# Altium schematic sheet wearable_sch.SchDoc: Medibox Wearable
size 431 x 279 mm; Author: Dhimant Tewari; DrawnBy: Aakashdip Dey; Organization: Vellore Institue of Technology; Address1: ADDRESS 1; Address2: ADDRESS 2; Address3: ADDRESS 3; Address4: ADDRESS 4; Revision: -; SheetNumber: 1; SheetTotal: 1; ENG_APP_DATE: --/--/--; DSN_APP_DATE: --/--/--; CHK_APP_DATE: --/--/--
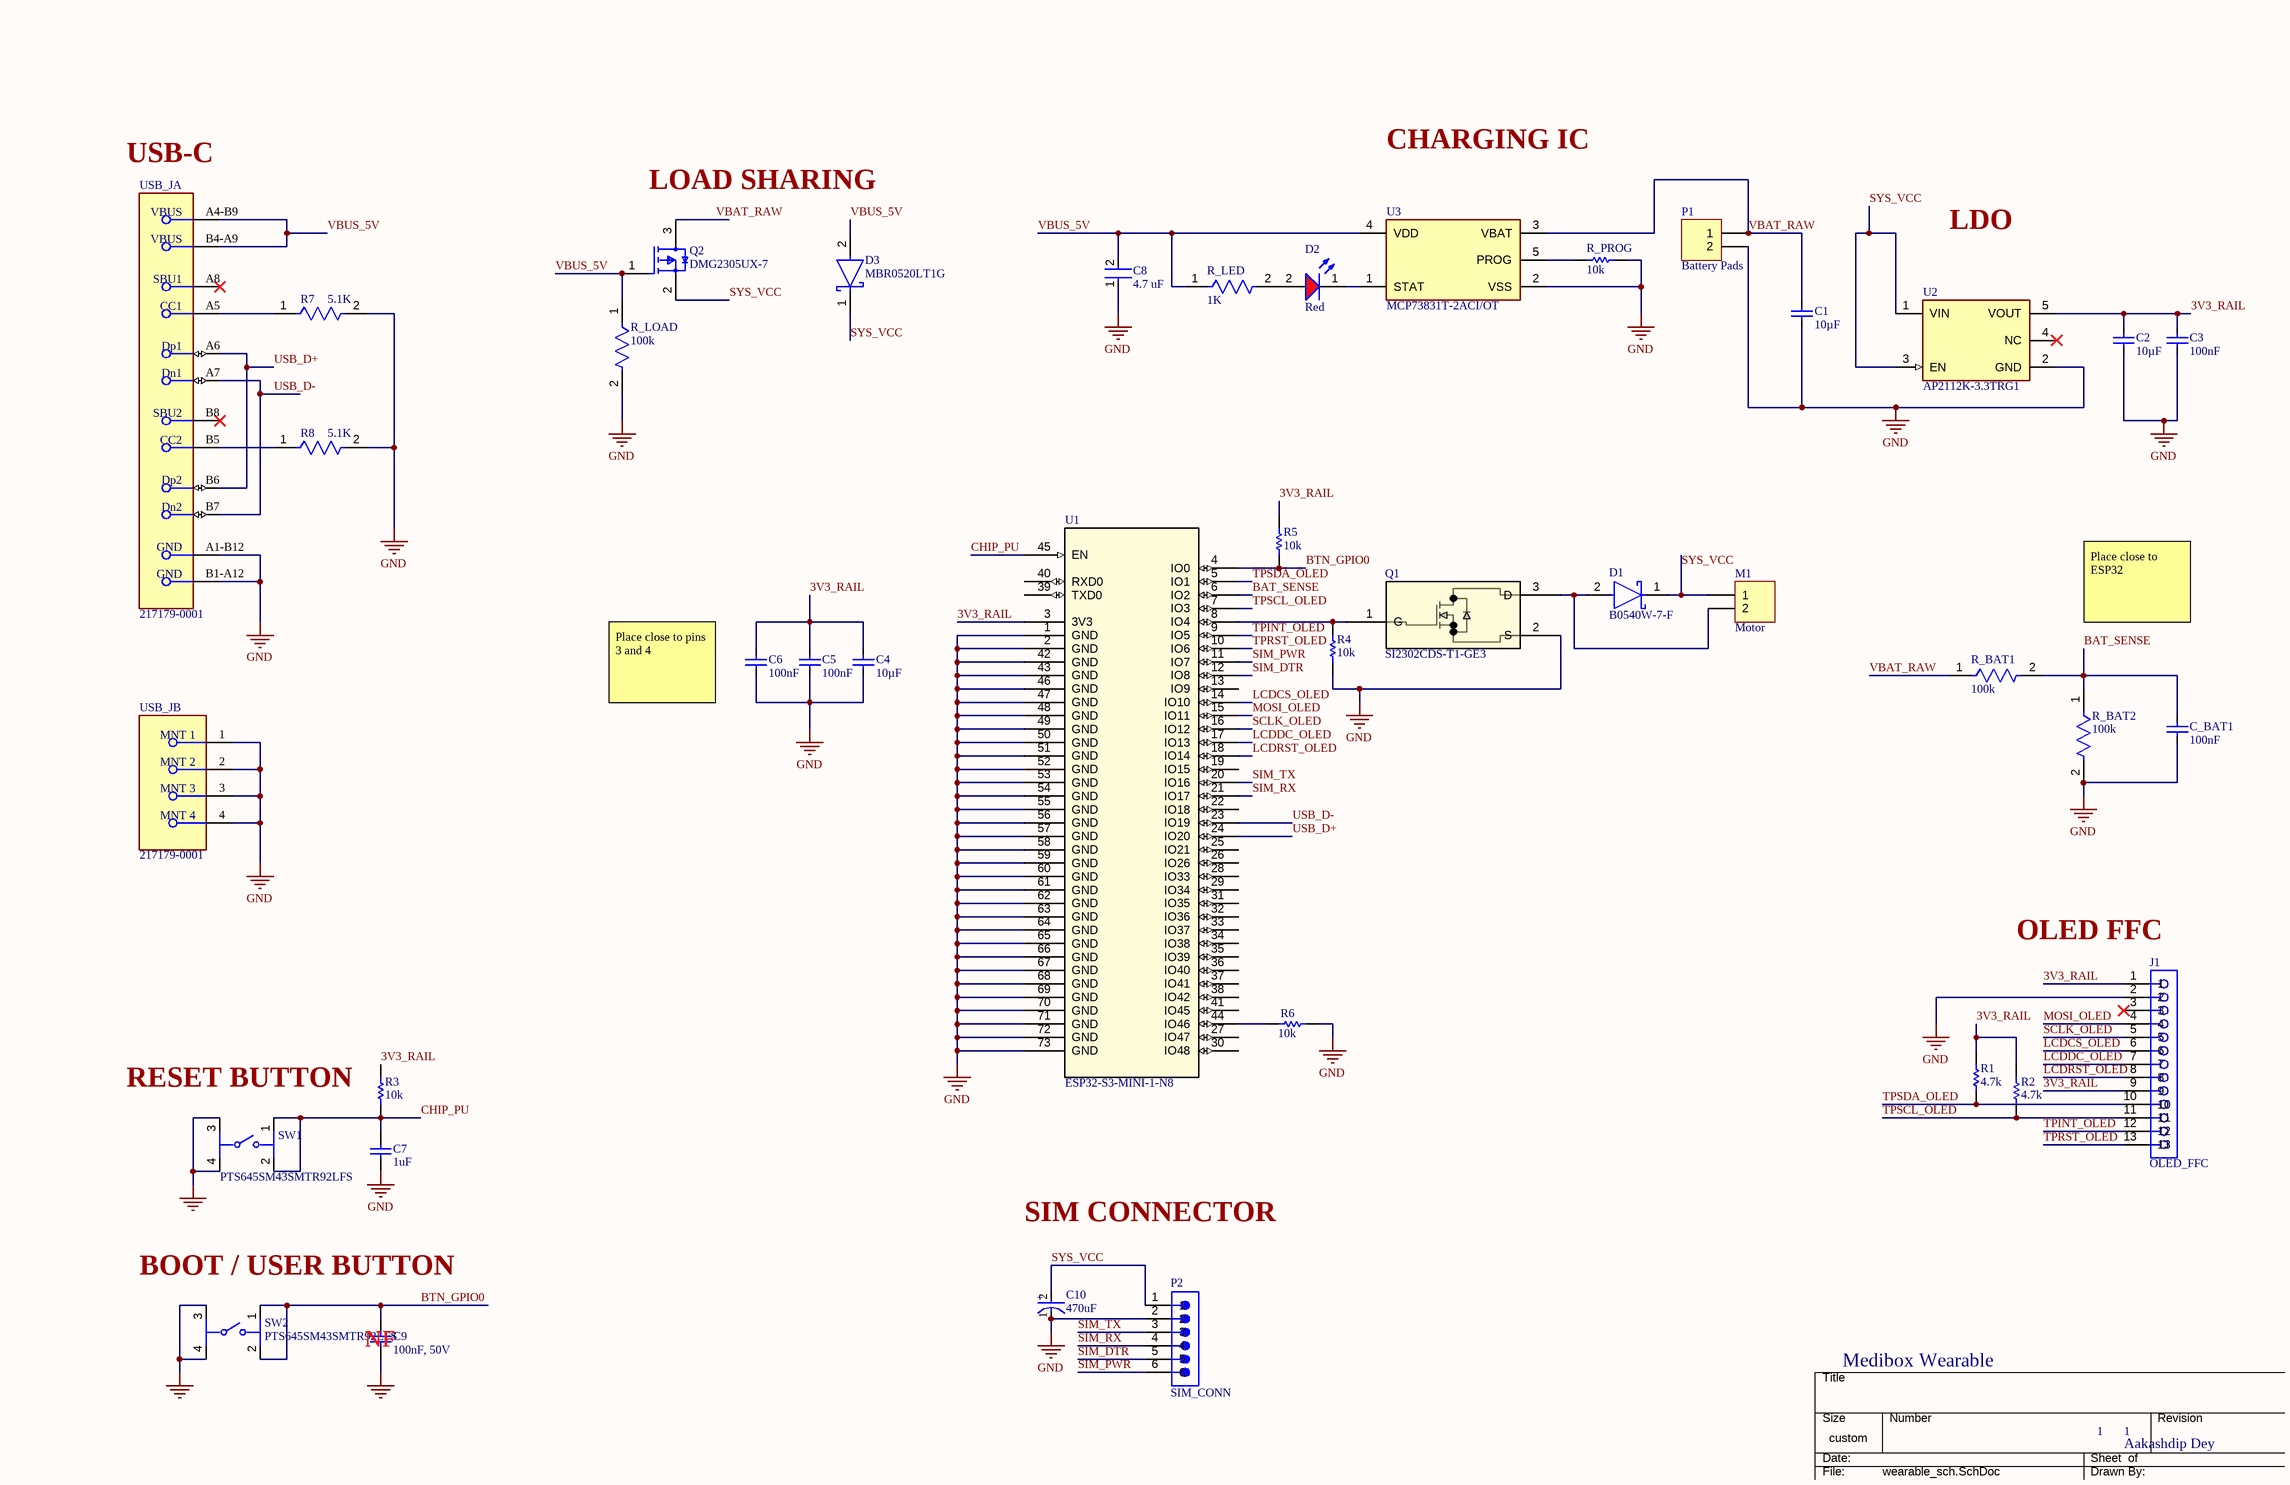
[diagram p0: wearable_sch.SchDoc]

## Parts
C1  value 10µF  [CAPC2013X135X45ML10T25]  (hidden comment: CAP_Murata)
C2  value 10µF  [CAPC2013X135X45ML10T25]  (hidden comment: CAP_Murata)
C3  100nF  [0603C_L]
C4  value 10µF  [CAPC2013X135X45ML10T25]  (hidden comment: CAP_Murata)
C5  100nF  [0603C_L]
C6  100nF  [0603C_L]
C7  1uF  [CAPC2013X145X50LL20T25]
C8  4.7 uF  [FP-GCM21B-0_15-IPC_A]
C9  100nF, 50V  [0603C_L]
C10  470uF  [FP-ECAS-D4-MFG]
C_BAT1  100nF  [0603C_L]
D1  B0540W-7-F  [FP-SOD123-MFG]
D2  Color: Red  [0603_A]  (hidden comment: LED_Red0603)
D3  MBR0520LT1G  [FP-425-04-IPC_C]
J1  OLED_FFC  [MOLX-52806-1310]
M1  Motor  [HDR1X2]
P1  Battery Pads  [HDR1X2]
P2  SIM_CONN  [SMTC-TSW-106-23-X-S]
Q1  SI2302CDS-T1-GE3  [TO-236_VIS-L]
Q2  DMG2305UX-7  [FP-SOT23-IPC_B]
R1  4.7k  [0603_L]
R2  4.7k  [0603_L]
R3  10k  [0603_L]
R4  10k  [0603_L]
R5  10k  [0603_L]
R6  10k  [0603_L]
R7  5.1K  [FP-CRCW0402-e3-IPC_A]
R8  5.1K  [FP-CRCW0402-e3-IPC_A]
R_BAT1  100k  [FP-MCS0402-MFG]
R_BAT2  100k  [FP-MCS0402-MFG]
R_LED  1K  [FP-AC0402-IPC_C]
R_LOAD  100k  [FP-MCS0402-MFG]
R_PROG  10k  [0603_L]
SW1  PTS645SM43SMTR92LFS  [FP-PTS645SM43SMTR92LFS-MFG]
SW2  PTS645SM43SMTR92LFS  [FP-PTS645SM43SMTR92LFS-MFG]
U1  ESP32-S3-MINI-1-N8  [ESP32-S3-MINI-1_EXP]
U2  AP2112K-3.3TRG1  [FP-SOT25-IPC_A]
U3  MCP73831T-2ACI/OT  [FP-C04-091-OT-IPC_B]
USB_J  217179-0001  [FP-2171790001-MFG]  (parts A,B of 2)

## Nets
GND: C1.2 C2.1 C3.1 C4.1 C5.1 C6.1 C7.1 C8.1 C9.1 C10.1(C) C_BAT1.1 J1.2 P1.2 P2.2 Q1.2(S) R4.1 R6.2 R7.2 R8.2 R_BAT2.2 R_LOAD.2 R_PROG.2 SW1.3 SW1.4 SW2.3 SW2.4 U1.1(GND) U1.2(GND) U1.42(GND) U1.43(GND) U1.46(GND) U1.47(GND) U1.48(GND) U1.49(GND) U1.50(GND) U1.51(GND) U1.52(GND) U1.53(GND) U1.54(GND) U1.55(GND) U1.56(GND) U1.57(GND) U1.58(GND) U1.59(GND) U1.60(GND) U1.61(GND) U1.62(GND) U1.63(GND) U1.64(GND) U1.65(GND) U1.66(GND) U1.67(GND) U1.68(GND) U1.69(GND) U1.70(GND) U1.71(GND) U1.72(GND) U1.73(GND) U2.2(GND) U3.2(VSS) USB_J.1(MNT_1) USB_J.2(MNT_2) USB_J.3(MNT_3) USB_J.4(MNT_4) USB_J.A1-B12(GND) USB_J.B1-A12(GND)
3V3_RAIL: C2.2 C3.2 C4.2 C5.2 C6.2 J1.1 J1.9 R1.2 R2.2 R3.1 R5.2 U1.3(3V3) U2.5(VOUT)
BAT_SENSE: C_BAT1.2 R_BAT1.2 R_BAT2.1 U1.6(IO2)
BTN_GPIO0: C9.2 R5.1 SW2.1 SW2.2 U1.4(IO0)
CHIP_PU: C7.2 R3.2 SW1.1 SW1.2 U1.45(EN)
LCDCS_OLED: J1.6 U1.14(IO10)
LCDDC_OLED: J1.7 U1.17(IO13)
LCDRST_OLED: J1.8 U1.18(IO14)
MOSI_OLED: J1.4 U1.15(IO11)
SCLK_OLED: J1.5 U1.16(IO12)
SIM_DTR: P2.5 U1.12(IO8)
SIM_PWR: P2.6 U1.11(IO7)
SIM_RX: P2.4 U1.21(IO17)
SIM_TX: P2.3 U1.20(IO16)
SYS_VCC: C10.2(A) D1.1(C) D3.1(C) M1.1 P2.1 Q2.2(SOURCE) U2.1(VIN) U2.3(EN)
TPINT_OLED: J1.12 U1.9(IO5)
TPRST_OLED: J1.13 U1.10(IO6)
TPSCL_OLED: J1.11 R2.1 U1.7(IO3)
TPSDA_OLED: J1.10 R1.1 U1.5(IO1)
USB_D+: U1.24(IO20) USB_J.A6(Dp1) USB_J.B6(Dp2)
USB_D-: U1.23(IO19) USB_J.A7(Dn1) USB_J.B7(Dn2)
VBAT_RAW: C1.1 P1.1 Q2.3(DRAIN) R_BAT1.1 U3.3(VBAT)
VBUS_5V: C8.2 D3.2(A) Q2.1(GATE) R_LED.1 R_LOAD.1 U3.4(VDD) USB_J.A4-B9(VBUS) USB_J.B4-A9(VBUS)
NetD1_2: D1.2(A) M1.2 Q1.3(D)
NetD2_1: D2.1(K) U3.1(STAT)
NetD2_2: D2.2(A) R_LED.2
NetQ1_1: Q1.1(G) R4.2 U1.8(IO4)
NetR6_1: R6.1 U1.44(IO46)
NetR7_1: R7.1 USB_J.A5(CC1)
NetR8_1: R8.1 USB_J.B5(CC2)
NetR_PROG_1: R_PROG.1 U3.5(PROG)

Not connected (* = marked no-connect by the designer): J1 3*; U1 13(IO9) 19(IO15) 22(IO18) 25(IO21) 26(IO26) 27(IO47) 28(IO33) 29(IO34) 30(IO48) 31(IO35) 32(IO36) 33(IO37) 34(IO38) 35(IO39) 36(IO40) 37(IO41) 38(IO42) 39(TXD0) 40(RXD0) 41(IO45); U2 4(NC)*; USB_J A8(SBU1)* B8(SBU2)*

## Notes on the sheet
- (near USB_J) USB-C
- CHARGING IC
- LOAD SHARING
- LDO
- Place close to ESP32
- (near C6) Place close to pins 3 and 4
- (near J1) OLED FFC
- (near SW1) RESET BUTTON
- SIM CONNECTOR
- BOOT / USER BUTTON
- (near C9) NF
- 1
- DWG. NO.
- REV.
- SHT.
- THIS DOCUMENT AND THE DATA DISCLOSED HEREIN OR HEREWITH IS THE PROPERTY OF ALTIUM LIMITED AND MAY BE FREELY DISTRIBUTED IN WHOLE. NO RIGHTS ARE RESERVED OR EXPRESS OR IMPLIED WARANTEE GIVEN.
- REVISION
- DESCRIPTION
- DATE
- APPROVED
- ENG:
- APPROVALS
- PROJECT
- DSN:
- CHK:
- REFERENCE DOCUMENTS
- PROJECT REVISION:
- TITLE
- DOCUMENT REVISION:
- DESIGN ITEM:
- BOM:
- FAB DWG:
- PCB DWG:
- ASSY DWG:
- SCALE:
- SIZE
- B
- CAGE CODE
- FILE NAME
- DWG NO.
- SHEET
- OF
- REV
- (in symbol CMP-00260-140750078-1) +

## Library data of the parts
C1 C2 C4 = CAP_10uF_25V_0805: Ceramic Capacitor, Multilayer, Ceramic, 25V, 10% +Tol, 10% -Tol, X5R, 15% TC, 10uF, Surface Mount, 0805; Manufacturer: Murata; Manufacturer Part Number: GRM21BR61E106KA73L; Tolerance: 10%; Case/Package: 0805; Max Operating Temperature: 85°C; Min Operating Temperature: -55°C; Mounting Technology: Surface Mount; Pins: 2; RoHS Compliant: Yes; Capacitor Type: Ceramic; Component Type: Capacitors
C3 C5 C6 C_BAT1 = Cap100nF_50V_0603: Ceramic Capacitor, Multilayer, Ceramic, 50V, 80% +Tol, 20% -Tol, Y5V, -82/+22% TC, 0.1uF, Surface Mount, 0603; Manufacturer: Yageo; Manufacturer Part Number: CC0603ZRY5V9BB104; Multilayer: Yes; Packaging: Tape and Reel; Case/Package: 0603; Dielectric Material: Ceramic; Height: 0.8mm; Length: 1.6mm; Max Operating Temperature: 85°C; Min Operating Temperature: -30°C; Mounting Technology: Surface Mount; Pins: 2; RoHS Compliant: Yes; Termination: Wraparound; Value: 100nF; Voltage Rating: 50V; Width: 0.8mm; Capacitor Type: Ceramic; JESD-609 Code: e3; Package Shape: Rectangular; Package Style: SMTMeter; Rated DC Voltage (URdc): 50V; Reach SVHC Compliant: Yes; Temperature Characteristics Code: Y5V; Terminal Finish: Nickel; Tolerance  (fill in as +-): 20%; Tolerance (fill in as +-): 80%; Component Type: Capacitors
C7 = CMP-1036-04746-2: Manufacturer: Kemet; Part Number: C0805C105K4PACTU
C8 = CMP-06035-015394-1: Ceramic Capacitor for Automotive 4.7uF ±20% 16VDC X7R 0805 Embossed T/R
C9 = CL05B104KB54PNC: CAP CER 0.1UF 50V X7R 0402; Manufacturer: Samsung; Dielectric Material: Ceramic; Supplier: Digikey; Supplier Part Number: 1276-CL05B104KB54PNCCT-ND; Manufacturer Part Number: CL05B104KB54PNC; RoHS: Yes; Category: Ceramic Capacitors; Stock: 1237875; Pricing: 1=0.1, 10=0.044, 50=0.025, 100=0.0194, 500=0.0146, 1000=0.01147, 2500=0.01043, 5000=0.00959 (USD); Pins: 2; Capacitor Type: Ceramic; RoHS Compliant: Yes; Reach SVHC Compliant: Yes; ComponentLink1URL: https://datasheet.ciiva.com:443/pdfs/VipMasterIC/IC/SEMS/SEMS-S-A0006318249/SEMS-S-A0006320959-1.pdf?src-supplier=IHS+Markit; ComponentLink1Description: https://datasheet.ciiva.com:443/pdfs/VipMasterIC/IC/SEMS/SEMS-S-A0006318249/SEMS-S-A0006320959-1.pdf?src-supplier=IHS+Markit; ComponentLink2URL: https://datasheet.octopart.com/CL05B104KB54PNC-Samsung-datasheet-8326407.pdf?src-supplier=TME; ComponentLink2Description: https://datasheet.octopart.com/CL05B104KB54PNC-Samsung-datasheet-8326407.pdf?src-supplier=TME; LCSC Part Number: C307331
C10 = CMP-00260-140750078-1: ECASD40E477M006KA0 Cap, 470UF, 2.5V, Alu Polymer, 2917 Rohs Compliant: Yes; Tolerance: 20%; Life (Hours): 2000hours; Capacitance: 470µF; Dissipation Factor: 6%; Ripple Current: 7.5A; ESR (Equivalent Series Resistance): 6mΩ; Leakage Current: 117.5µA; Voltage Rating: 2.5V; Height: 2mm; NexarPartId: 140750078; Min Operating Temperature: -40°C; Case/Package: 2917; Max Operating Temperature: 105°C
D1 = CMP-2000-05880-2: DIODE SCHOTTKY 40V 500MA SOD123; Manufacturer: Diodes Inc.; Capacitance: 170pF; Max Junction Temp: +150°C; Value: 170pF; Peak Reverse Current: 20uA; Automotive Grade: Grade 0; Max Surge Forward Current: 5.5A; Standoff Height: 0mm; Forward Current: 0.5A; Digikey Description: DIODE SCHOTTKY 40V 500MA SOD123; ComponentLink2Description: Datasheet; Package: SOD123; Height: 1.45mm; Temperature Range High: +150°C; Mouser Description: Schottky Diodes & Rectifiers 40V 410mW; Category: Diode; Temperature: -65°C to +150°C; Reverse Voltage: 40V; Manufacturer Part Number: B0540W-7-F; Footprint Url: https://www.diodes.com/assets/Package-Files/SOD123.pdf; Octopart: https://octopart.com/b0540w-7-f-diodes+inc.-325656; Device Class L1: Discrete Semiconductors; Automotive: Yes; ComponentLink2URL: https://www.diodes.com/assets/Datasheets/ds30138.pdf; Lead Free: Yes; Temperature Range Low: -65°C; Device Class L3: Schottky Diodes; RoHS: TRUE; Max Repetitive Reverse Voltage: 40V; Device Class L2: Diodes
D2 = LED_Red0603: Single Color LED, Red, Water Clear, 1.1mm; Manufacturer: Wurth Electronics; Manufacturer Part Number: 150060RS75000; Viewing Angle: 140°; Overall Height: 0.7mm; Luminous Intensity-Nom: 250mcd; Forward Voltage: 2V; Forward Current: 30mA; Shape: Rectangular; Case/Package: 0603; Mounting Technology: Surface Mount; Pins: 2; Max Operating Temperature: 85°C; Colour: RED; Min Operating Temperature: -40°C; RoHS Compliant: Yes; Size: 1.1mm; Optoelectronic Device Type: SINGLE COLOR LED; Lens Style: WATER CLEAR; Terminal Pitch: 1.6mm; Component Type: LED
D3 = CMP-1055-00425-2: DIODE SCHOTTKY 20V 500MA SOD123; Polarity: Standard; Peak Non-Repetitive Surge Current: 5.5A; Forward Voltage: 385mV; Element Configuration: Single; Peak Reverse Current: 250uA; Max Repetitive Reverse Voltage (Vrrm): 20V; Voltage Rating (DC): 20V; Case/Package: SOD-123-2; Number of Pins: 2; Output Current: 500mA; Min Operating Temperature: -65°C; Lead Free: Lead Free; REACH SVHC: No SVHC; Max Reverse Voltage (DC): 20V; Termination: SMD/SMT; Average Rectified Current: 500mA; Max Surge Current: 5.5A; Package Quantity: 3000; Height: 1.12mm; Current Rating: 500mA; Forward Current: 500mA; Max Forward Surge Current (Ifsm): 5.5A; Packaging: Tape and Reel; Length: 2.69mm; Radiation Hardening: No; Max Reverse Leakage Current: 250uA; Width: 1.6mm; Contact Plating: Tin; Max Operating Temperature: 125°C
J1 = CMP-1242-00170-1: 1.0 mm Pitch FFC Connector, 5.4 mm Mated Height, Vertical, Non-ZIF, Through Hole, 13 Circuits, -20 to 80 degC, ELV and RoHS Compliant, Tray; PartNumber: 52806-1310; Manufacturer: Molex; Polarized to PCB: No; Current (Max per Contact): 0.5A; Voltage (Max): 50V AC (RMS)/DC; Material - Metal: Phosphor Bronze; PCB Retention: None; Pitch - Mating Interface: 1.00mm; Circuits (maximum): 13; Material - Plating Termination: Tin; Mated Height: 5.40mm; Durability (mating cycles max): 10; Number of Rows: 1; Stackable: No; PCB Locator: No; ComponentLink3URL: http://www.molex.com/pdm_docs/sd/528061310_sd.pdf; Contact Position: N/A; ComponentLink1URL: http://www.molex.com/molex/index.jsp; RoHS: TRUE; Mounting Technology: Through Hole; ComponentLink2URL: http://www.molex.com/webdocs/datasheets/pdf/en-us/0528061310_FFC_FPC_CONNECTORS.pdf; Circuits (Loaded): 13; ComponentLink3Description: Package Specification; Material - Plating Mating: Tin; Entry Angle: Vertical; Pitch - Termination Interface: 1.00mm; PackageDescription: 13-Lead FFC Connector, Pitch 1.0 mm; PackageVersion: Rev. B, 08/2002; ComponentLink1Description: Manufacturer URL; Orientation: Vertical; ComponentLink2Description: Datasheet; Packing: Tray; PackageReference: 52806-1310
M1 P1 = Header 2: Header, 2-Pin; LatestRevisionDate: 17-Jul-2002; LatestRevisionNote: Re-released for DXP Platform.; Publisher: Altium Limited
P2 = CMP-1024-00397-1: 0.025" SQ Post Header, Through-hole, Vertical, -55 to 125 degC, 2.54 mm Pitch, 6-Pin, Male, RoHS; Manufacturer: Samtec; PartNumber: TSW-106-23-L-S; Pitch: 2.54 mm; DatasheetVersion: F-214; PackageReference: TSW-106-23-X-S; Mounting Technology: Through-hole; ComponentLink2URL: http://www.samtec.com/documents/webfiles/pdf/TSW_TH.PDF; ComponentLink3URL: http://www.samtec.com/documents/webfiles/cpdf/TSW-XXX-XX-XXX-X-XX-XXX-MKT.pdf; Orientation: Vertical; PackageVersion: DM, 8/1988; RoHS: True; ComponentLink3Description: Package Specification; ComponentLink1URL: http://www.samtec.com; Temperature Range: -55 to 125 degC; ComponentLink2Description: Datasheet; ComponentLink1Description: Manufacturer URL; PackageDescription: .025[0.64] SQ. Post Terminal Strip Assembly
Q1 = SI2302CDS-T1-GE3: N-CHANNEL 20-V (D-S) MOSFET; Manufacturer_Name: Vishay; Copyright: Copyright (C) 2026 Ultra Librarian. All rights reserved.; Manufacturer_Part_Number: SI2302CDS-T1-GE3; RefDes: RefDes; Type: Type
Q2 = CMP-1693-00002-4: MOSFET P-CH 20V 4.2A SOT23; Turn-On Delay Time: 10.8ns; Turn-Off Delay Time: 79.3ns; Threshold Voltage: -900mV; Rise Time: 13.7ns; Gate to Source Voltage (Vgs): 8V; Rds On Max: 52mR; Element Configuration: Single; Fall Time: 34.7ns; Max Power Dissipation: 1.4W; Drain to Source Resistance: 200mR; Number of Channels: 1; Input Capacitance: 808pF; Lead Free: Lead Free; Number of Pins: 3; Length: 3mm; Continuous Drain Current (ID): 4.2A; Contact Plating: Tin; Mount: Surface Mount; Weight: 0.000282oz; Min Operating Temperature: -55°C; Package Quantity: 3000; Drain to Source Voltage (Vdss): 20V; On-State Resistance: 52MR; Max Operating Temperature: 150°C; Height: 1.1mm; REACH SVHC: No SVHC; Packaging: Tape and Reel; Radiation Hardening: No; Case/Package: SOT-23; Width: 1.4mm
R1 R2 = Res4K7_0603: Manufacturer: Yageo; Manufacturer Part Number: RT0603DRD074K99L; Tolerance: 0.5%; Power (Watts): 0.1W, 1/10W; Temperature Coefficient: ±25ppm/°C; RoHS: RoHS Compliant; Category: Resistors; Stock 1: 28874; Pricing 1: 1=0.22, 10=0.184, 25=0.134, 100=0.0721, 250=0.05532, 500=0.04358, 1000=0.03018, 2500=0.02766 (USD); Packaging: Cut Tape (CT); Part Status: Active; Resistance (Ohms): 4.7k; Composition: Thin Film; Features: Moisture Resistant; Operating Temperature: -55°C ~ 155°C; Package / Case: 0603 (1608 Metric); Supplier Device Package: 0603; Size / Dimension: 0.063" L x 0.031" W (1.60mm x 0.80mm); Height: 0.022" (0.55mm); Number of Terminations: 2; Failure Rate: -; ComponentLink1URL: http://www.yageo.com/documents/recent/PYu-RT_1-to-0.05_RoHS_L_6.pdf; ComponentLink1Description: http://www.yageo.com/documents/recent/PYu-RT_1-to-0.05_RoHS_L_6.pdf; Design Item ID: Res4K7_0603; Source: WCT.SchLib; Component Type: Resistors
R3-R6 R_PROG = Res10K_0603: Manufacturer: Panasonic Electronic Components; Manufacturer Part Number: ERJ-3GEYJ102V; Manufacturer: Panasonic; Tolerance: 5%; Power (Watts): 0.1W, 1/10W; Temperature Coefficient: ±200ppm/°C; RoHS: RoHS Compliant; Category: Resistors; Packaging: Cut Tape (CT); Part Status: Active; Resistance (Ohms): 10k; Composition: Thick Film; Features: Automotive AEC-Q200; Operating Temperature: -55°C ~ 155°C; Package / Case: 0603 (1608 Metric); Supplier Device Package: 0603; Size / Dimension: 0.063" L x 0.031" W (1.60mm x 0.80mm); Height: 0.022" (0.55mm); Number of Terminations: 2; Failure Rate: -; Design Item ID: Res10K_0603; Source: WCT.SchLib; Component Type: Resistors
R7 R8 = CMP-02407-004842-1: RES Thick Film, 5.1kΩ, 5%, 0.063W, 200ppm/°C, 0402; Resistance: 5.1kR; Max Power Dissipation: 63mW; Number of Terminations: 2; Length: 0.039inch; Composition: Thick Film; Max Operating Temperature: 155°C; Min Operating Temperature: -55°C; Features: Automotive AEC-Q200; Width: 0.02inch; Lead Free: Lead Free; Case/Package: 0402; Temperature Coefficient: 200ppm/°C; Packaging: Tape and Reel; Height: 0.016inch; Package Quantity: 50000; Tolerance: 5%
R_BAT1 R_BAT2 R_LOAD = CMP-02407-011782-1: RES SMD 1.2K OHM 1% 1/10W 0402; Power Rating: 63mW; Tolerance: 0.1%; Voltage Rating (DC): 50V; Temperature Coefficient: 25ppm/°C; Resistance: 100kR; Length: 1mm; Height: 0.015inch; Number of Terminations: 2; Depth: 0.5mm; Military Standard: Not; Case Code (Imperial): 0402; Min Operating Temperature: -55°C; Series: MCS 0402 - Precision; Construction: Rectangular; Max Operating Temperature: 125°C; Width: 0.5mm; Max Power Dissipation: 63mW; Case Code (Metric): 1005; Package Quantity: 1000; Case/Package: 0402; RoHS Compliant: Yes; Packaging: Tape and Reel; Lead Free: Lead Free; Weight: 2.1E-05oz; Resistor Type: Thin Film; Voltage Rating: 50V; Radiation Hardening: No; Contact Plating: Tin
R_LED = CMP-03412-047873-1: RES 1kΩ ±1% 0.063W 0402; RoHS Compliant: Yes
SW1 SW2 = CMP-2000-05160-2: SWITCH TACTILE SPST-NO 0.05A 12V; Actuator Type: Standard; Contact Resistance: 100mR; Switch Function: Off-Mom; Throw Configuration: SPST; Illumination Type: Non-Illuminated; Mechanical Life: 100000Cycles; Current Rating: 50mA; Actuator Length: 0.85mm; Actuator Material: Nylon; Operating Force: 160gf; Min Operating Temperature: -20°C; Max Operating Temperature: 60°C; Termination: Gull Wing; REACH SVHC: No SVHC; Case/Package: SMD/SMT; Packaging: Tape and Reel; Mount: Surface Mount; Voltage Rating (DC): 12V; Orientation: Straight; Lead Free: Lead Free; Contact Material: Silver; Color: Black; Max Current Rating: 50mA; Contact Plating: Silver; Depth: 9mm; Package Quantity: 1; Max Voltage Rating (DC): 12V; Length: 6mm
U1 = ESP32-S3: SMD module, ESP32-S3FN8, 8 MB SPI flash, PCB antenna; Manufacturer: Espressif Systems; Supplier: DigiKey; Supplier Part Number: 5407-ESP32-S3-MINI-1-N8CT-ND; Manufacturer Part Number: ESP32-S3-MINI-1-N8; RoHS: Compliant; Category: RF Transceiver Modules and Modems; Stock: 7176; Pricing: 1=5.43, 10=4.703, 25=4.4492, 100=4.0995, 250=3.89008 (USD); ComponentLink1URL: https://datasheet.octopart.com:443/ESP32-S3-MINI-1-N8-Espressif-Systems-datasheet-194171672.pdf?src-supplier=LCSC; ComponentLink1Description: https://datasheet.octopart.com:443/ESP32-S3-MINI-1-N8-Espressif-Systems-datasheet-194171672.pdf?src-supplier=LCSC; ComponentLink2URL: https://datasheet.octopart.com:443/ESP32-S3-MINI-1-N8-Espressif-Systems-datasheet-188867343.pdf?src-supplier=TME; ComponentLink2Description: https://datasheet.octopart.com:443/ESP32-S3-MINI-1-N8-Espressif-Systems-datasheet-188867343.pdf?src-supplier=TME; ComponentLink3URL: https://datasheet.octopart.com:443/ESP32-S3-MINI-1-N8-Espressif-Systems-datasheet-165560562.pdf?src-supplier=TME; ComponentLink3Description: https://datasheet.octopart.com:443/ESP32-S3-MINI-1-N8-Espressif-Systems-datasheet-165560562.pdf?src-supplier=TME; ComponentLink4URL: https://datasheet.octopart.com:443/ESP32-S3-MINI-1-N8-Espressif-Systems-datasheet-165560559.pdf?src-supplier=TME; ComponentLink4Description: https://datasheet.octopart.com:443/ESP32-S3-MINI-1-N8-Espressif-Systems-datasheet-165560559.pdf?src-supplier=TME; ComponentLink5URL: https://datasheet.octopart.com:443/ESP32-S3-MINI-1-N8-Espressif-Systems-datasheet-192318068.pdf?src-supplier=HQonline; ComponentLink5Description: https://datasheet.octopart.com:443/ESP32-S3-MINI-1-N8-Espressif-Systems-datasheet-192318068.pdf?src-supplier=HQonline; LCSC Part No.: C2913206
U2 = CMP-12756-000035-1: IC REG LINEAR 3.3V 600MA SOT25; Number of Regulators: 1; Output Type: Fixed; Polarity: Positive; Min Input Voltage: 2.5V; Max Input Voltage: 6V; Accuracy: 1.5%; Quiescent Current: 55uA; Dropout Voltage: 250mV; Min Operating Temperature: -40°C; Length: 3.1mm; Output Current: 600mA; Max Operating Temperature: 85°C; Package Quantity: 1; Output Voltage: 3.3V; Width: 1.7mm; Number of Outputs: 1; Packaging: Tape and Reel; Height: 1.3mm; Lead Free: Lead Free; Max Output Current: 600mA; Case/Package: SOT-23-5; Mount: Surface Mount; Number of Pins: 5
U3 = CMP-0133-00143-2: IC CONTROLLR LI-ION 4.2V SOT23-5; Max Power Dissipation: 1.54W; Output Current: 500mA; Max Output Voltage: 4.5V; Number of Outputs: 1; Min Output Voltage: 4.168V; Min Supply Voltage: 3.75V; Max Input Voltage: 6V; Voltage Rating: 4.534V; Drain to Source Resistance: 350mR; Max Operating Temperature: 85°C; Length: 0.122inch; Number of Pins: 5; REACH SVHC: No SVHC; Radiation Hardening: No; Min Operating Temperature: -40°C; Weight: 0.00709oz; Contact Plating: Tin; Termination: SMD/SMT; Case/Package: SOT-23; Mount: Surface Mount; Width: 0.071inch; Packaging: Tape and Reel; Number of Cells: 1; Max Charge Current: 500mA; Height: 0.051inch; Number of Channels: 1; Output Voltage: 4.2V; Max Supply Voltage: 6V; Lead Free: Lead Free
USB_J = CMP-04767-000028-2: CONN RCP USB2.0 TYP C 24P SMD RA; NexarPartId: 117190526; Gender: Receptacle; Number of Contacts: 16; Current Rating: 1.25A; Voltage Rating: 30V; Min Operating Temperature: -40°C; USB Standard: USB 2.0; Height: 3.36mm; Contact Material: Gold, Nickel; Max Operating Temperature: 85°C